# EAGLE schematic Rev 1 (EAGLE 9.5.2)

## Sheet 1 of 8: Battery and Charger
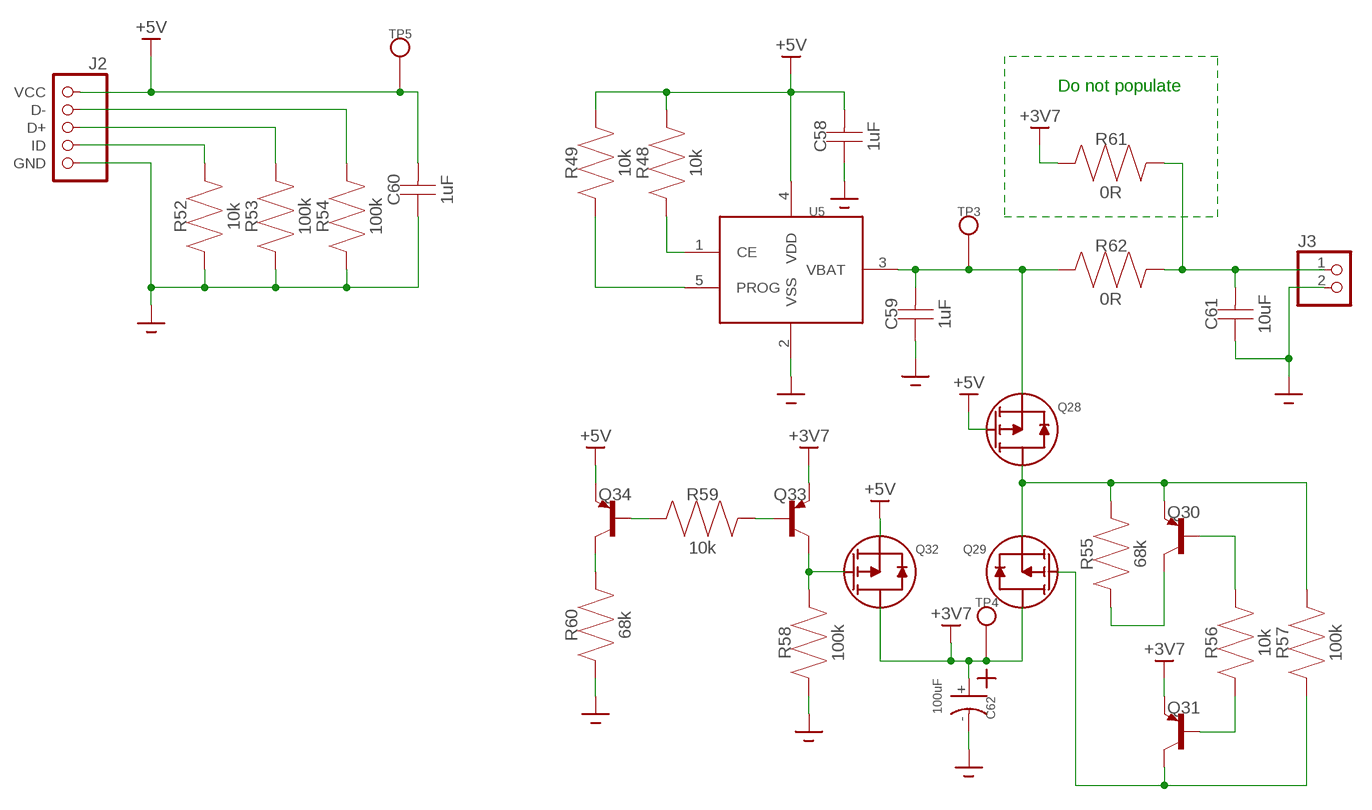
[diagram p0: schematic, sheet 1]

### Parts
C58  1uF  CAPACITOR0805  [0805]
C59  1uF  CAPACITOR0805  [0805]
C60  1uF  CAPACITOR0805  [0805]
C61  10uF  CAPACITOR0805  [0805]
C62  100uF  EEE-1EA101AP  [EEE-1EA101AP]
J2  10118194-0001LF  [10118194-0001LF]
J3  B2B-PH-K-S(LF)(SN)  [B2B-PH-K-S(LF)(SN)]
Q28  SI7157DP  [SI7157DP]
Q29  SI7157DP  [SI7157DP]
Q30  MMBT3906  [SOT96P237X112-3]
Q31  MMBT3906  [SOT96P237X112-3]
Q32  SI7157DP  [SI7157DP]
Q33  MMBT3906  [SOT96P237X112-3]
Q34  MMBT3906  [SOT96P237X112-3]
R48  10k  RESISTOR0402  [0402]
R49  10k  RESISTOR0402  [0402]
R52  10k  RESISTOR0402  [0402]
R53  100k  RESISTOR0402  [0402]
R54  100k  RESISTOR0402  [0402]
R55  68k  RESISTOR0603  [0603]
R56  10k  RESISTOR0603  [0603]
R57  100k  RESISTOR0603  [0603]
R58  100k  RESISTOR0805  [0805]
R59  10k  RESISTOR0805  [0805]
R60  68k  RESISTOR0805  [0805]
R61  0R  RESISTOR0805  [0805]
R62  0R  RESISTOR0805  [0805]
TP3  TESTPOINT  [TESTPOINT]
TP4  TESTPOINT  [TESTPOINT]
TP5  TESTPOINT  [TESTPOINT]
U5  MCP73811  [MCP73811]

### Nets
+3V7: C62.+ Q29.5(D) Q29.6(D) Q29.7(D) Q29.8(D) Q29.9(D) Q29.10(D) Q29.11(D) Q31.2(E) Q32.5(D) Q32.6(D) Q32.7(D) Q32.8(D) Q32.9(D) Q32.10(D) Q32.11(D) Q33.2(E) R61.P$1 TP4.P1 ; also sheet 2,8
+5V: C58.P$2 C60.P$2 J2.1(VCC) Q28.4(G) Q32.1(S) Q32.2(S) Q32.3(S) Q34.2(E) R48.2 R49.2 TP5.P1 U5.4(VDD)
GND: C58.P$1 C59.P$1 C60.P$1 C61.P$1 C62.- J2.5(GND) J2.6(GND) J2.7(GND) J2.8(GND) J2.9(GND) J2.10(GND) J2.11(GND) J2.12(GND) J2.13(GND) J2.14(GND) J2.15(GND) J3.2 R52.1 R53.1 R54.1 R58.P$1 R60.P$1 U5.2(VSS) ; also sheet 2,3,4,5,6,7,8
N$65: C59.P$2 Q28.1(S) Q28.2(S) Q28.3(S) R62.P$1 TP3.P1 U5.3(VBAT)
N$66: R48.1 U5.1(CE)
N$67: R49.1 U5.5(PROG)
N$68: Q30.3(C) R55.1
N$69: Q28.5(D) Q28.6(D) Q28.7(D) Q28.8(D) Q28.9(D) Q28.10(D) Q28.11(D) Q29.1(S) Q29.2(S) Q29.3(S) Q30.2(E) R55.2 R57.2
N$70: Q31.1(B) R56.1
N$71: Q30.1(B) R56.2
N$72: J2.4(ID) R52.2
N$73: J2.3(D+) R53.2
N$74: J2.2(D-) R54.2
N$75: Q29.4(G) Q31.3(C) R57.1
N$76: Q32.4(G) Q33.3(C) R58.P$2
N$77: Q34.1(B) R59.P$1
N$78: Q33.1(B) R59.P$2
N$79: Q34.3(C) R60.P$2
N$104: C61.P$2 J3.1 R61.P$2 R62.P$2

### Notes on the sheet
- Do not populate

## Sheet 2 of 8: Power Regulation
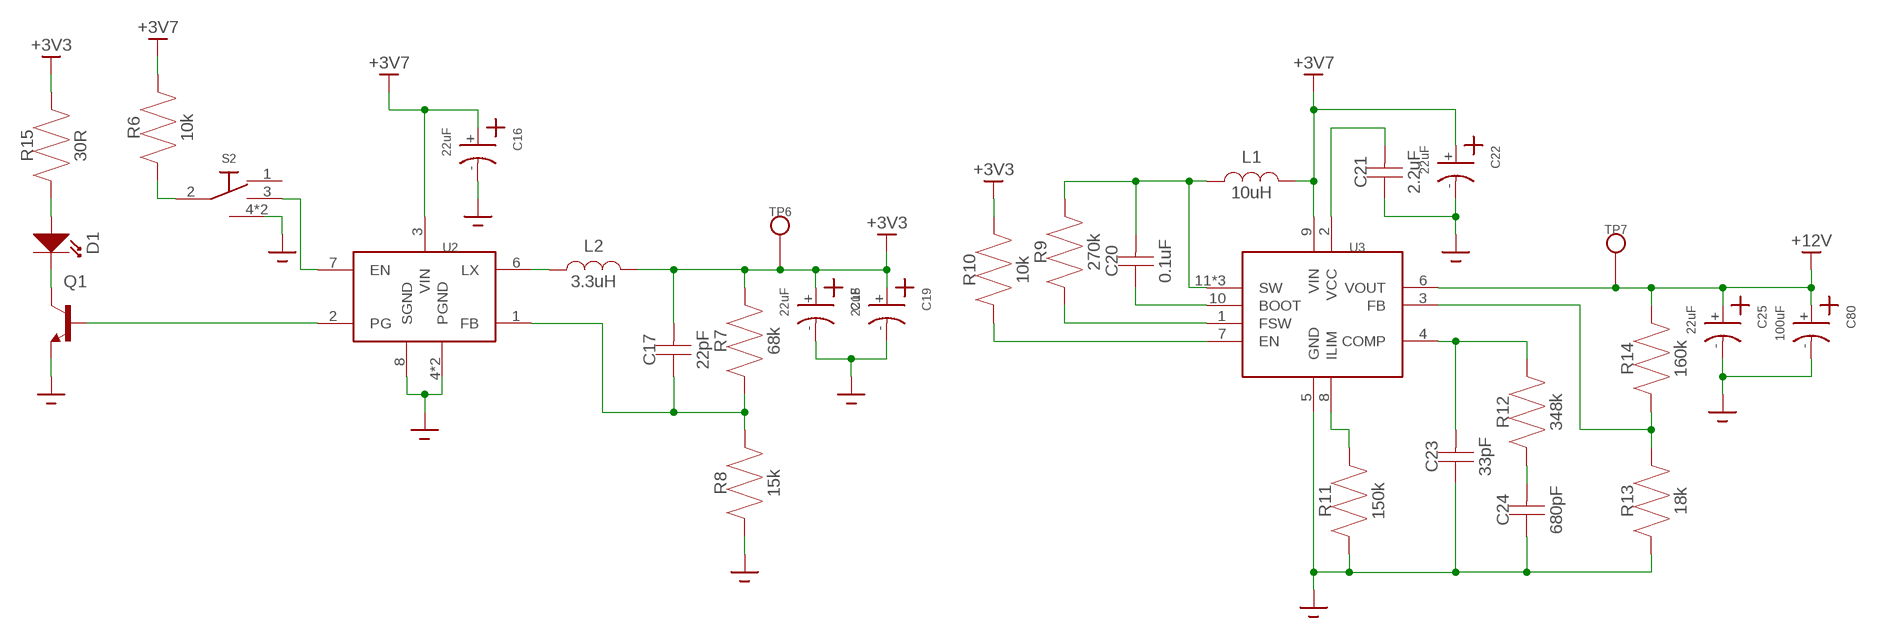
[diagram p1: schematic, sheet 2]

### Parts
C16  22uF  865080542006  [865080542006]
C17  22pF  CAPACITOR0805  [0805]
C18  22uF  865080542006  [865080542006]
C19  22uF  865080542006  [865080542006]
C20  0.1uF  CAPACITOR0402  [0402]
C21  2.2uF  CAPACITOR0402  [0402]
C22  22uF  865080542006  [865080542006]
C23  33pF  CAPACITOR0402  [0402]
C24  680pF  CAPACITOR0402  [0402]
C25  22uF  865080542006  [865080542006]
C80  100uF  EEE-1EA101AP  [EEE-1EA101AP]
D1  LED1206  [1206]
L1  10uH  104CDMCC  [104CDMCC]
L2  3.3uH  NRS5040  [NRS5040]
Q1  MMBT3904,215MMBT3904,215  [SOT95P230X110-3]
R6  10k  RESISTOR0805  [0805]
R7  68k  RESISTOR0805  [0805]
R8  15k  RESISTOR0805  [0805]
R9  270k  RESISTOR0402  [0402]
R10  10k  RESISTOR0603  [0603]
R11  150k  RESISTOR0603  [0603]
R12  348k  RESISTOR0402  [0402]
R13  18k  RESISTOR0402  [0402]
R14  160k  RESISTOR0402  [0402]
R15  30R  RESISTOR0805  [0805]
S2  OS102011MS2QN1  [OS102011MS2QN1]
TP6  TESTPOINT  [TESTPOINT]
TP7  TESTPOINT  [TESTPOINT]
U2  AP3441  [AP3441]
U3  TPS61089  [TPS61089]

### Nets
+3V3: C17.P$2 C18.+ C19.+ L2.2 R7.P$2 R10.2 R15.P$2 TP6.P1 ; also sheet 3,4,5,6,7
+3V7: C16.+ C22.+ L1.2 R6.P$2 U2.3(VIN) U3.9(VIN) ; also sheet 1,8
+12V: C25.+ C80.+ R14.2 TP7.P1 U3.6(VOUT) ; also sheet 4
GND: C16.- C18.- C19.- C21.1 C22.- C23.1 C24.1 C25.- C80.- Q1.2(E) R8.P$1 R11.1 R13.1 S2.4(GND) S2.5(GND) U2.4(PGND) U2.8(SGND) U2.9(PGND) U3.5(GND) ; also sheet 1,3,4,5,6,7,8
N$3: L2.1 U2.6(LX)
N$5: C17.P$1 R7.P$1 R8.P$2 U2.1(FB)
N$6: S2.3 U2.7(EN)
N$7: R6.P$1 S2.2(COMMON)
N$8: C20.1 U3.10(BOOT)
N$9: R9.1 U3.1(FSW)
N$10: C20.2 L1.1 R9.2 U3.11(SW) U3.12(SW) U3.13(SW)
N$11: R11.2 U3.8(ILIM)
N$12: C21.2 U3.2(VCC)
N$13: C23.2 R12.2 U3.4(COMP)
N$14: R10.1 U3.7(EN)
N$15: C24.2 R12.1
N$16: Q1.1(B) U2.2(PG)
N$17: R13.2 R14.1 U3.3(FB)
N$18: D1.2(OUT) Q1.3(C)
N$19: D1.1(IN) R15.P$1
Unconnected: S2.1

## Sheet 3 of 8: MCU
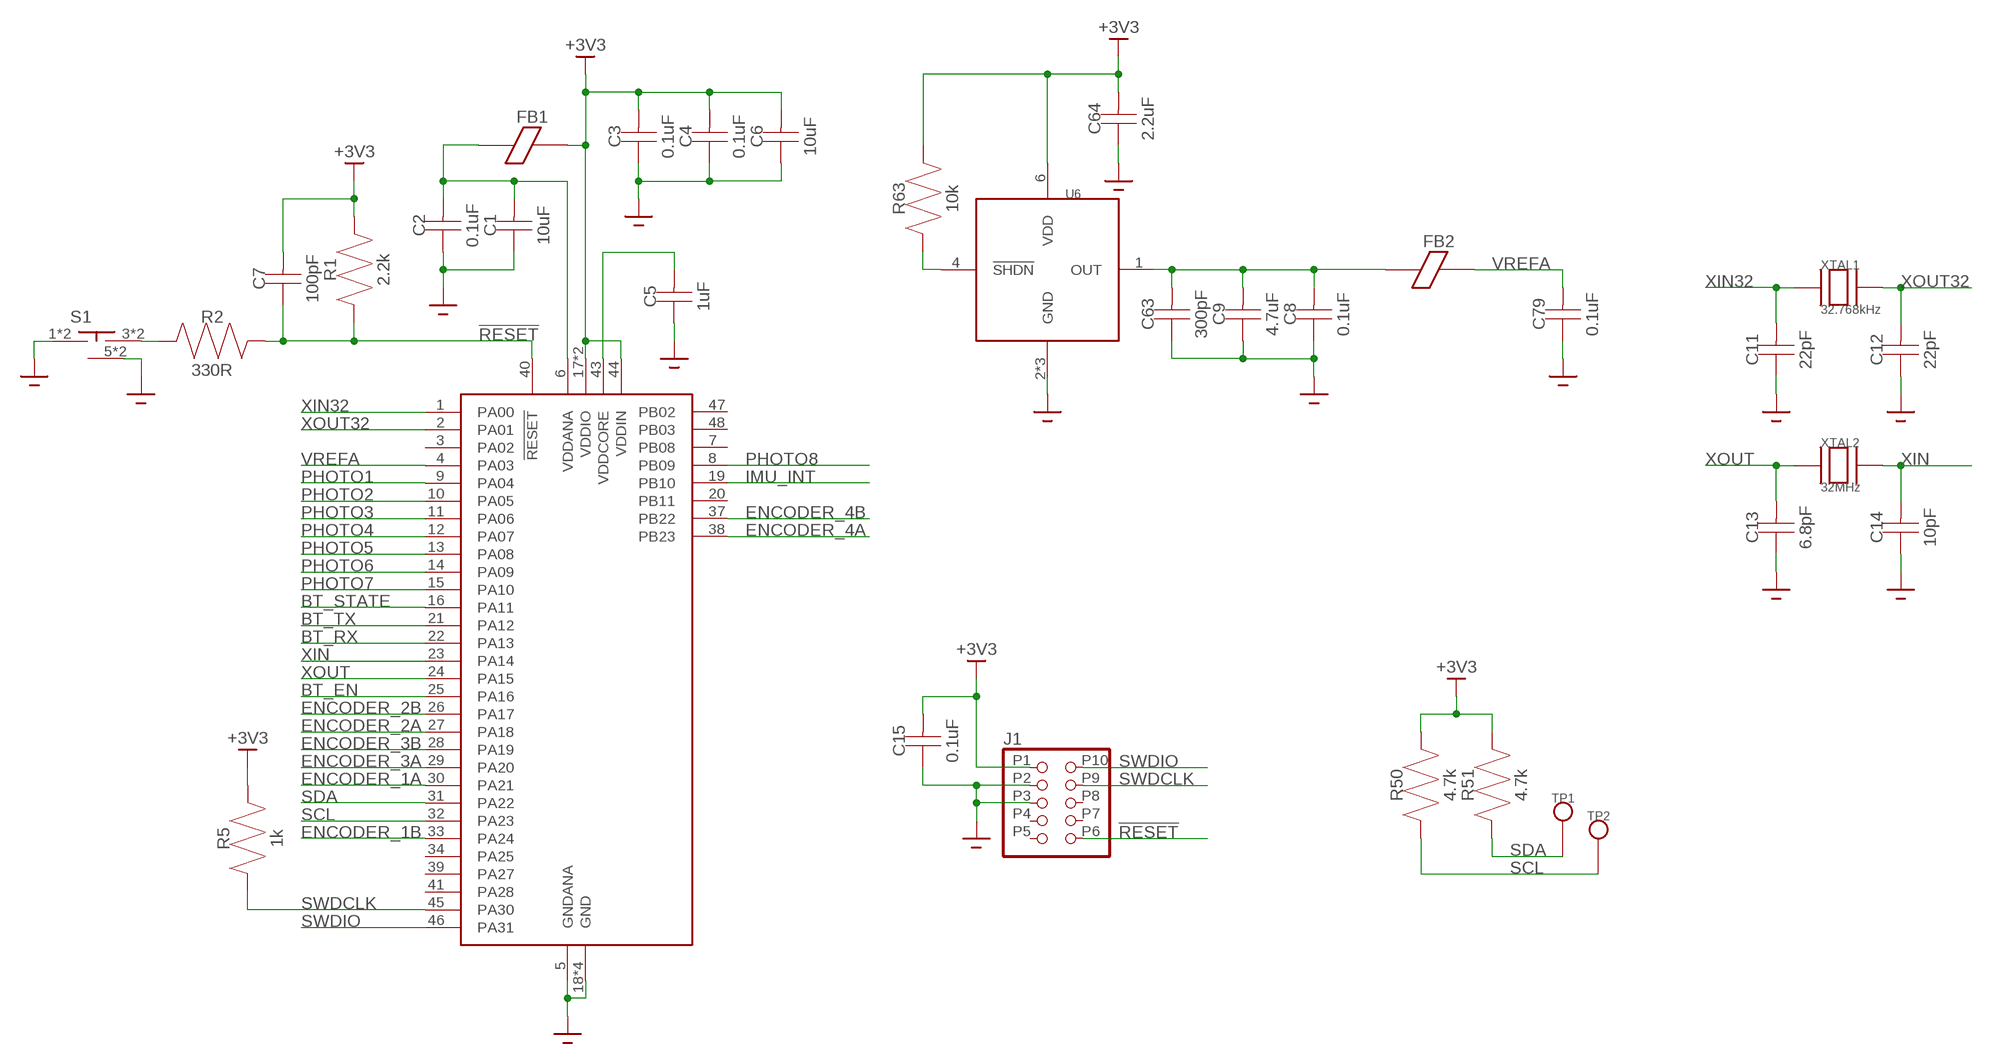
[diagram p2: schematic, sheet 3]

### Parts
C1  10uF  CAPACITOR0402  [0402]
C2  0.1uF  CAPACITOR0402  [0402]
C3  0.1uF  CAPACITOR0402  [0402]
C4  0.1uF  CAPACITOR0402  [0402]
C5  1uF  CAPACITOR0402  [0402]
C6  10uF  CAPACITOR0402  [0402]
C7  100pF  CAPACITOR0603  [0603]
C8  0.1uF  CAPACITOR0402  [0402]
C9  4.7uF  CAPACITOR0402  [0402]
C11  22pF  CAPACITOR0402  [0402]
C12  22pF  CAPACITOR0402  [0402]
C13  6.8pF  CAPACITOR0402  [0402]
C14  10pF  CAPACITOR0402  [0402]
C15  0.1uF  CAPACITOR0603  [0603]
C63  300pF  CAPACITOR0402  [0402]
C64  2.2uF  CAPACITOR0402  [0402]
C79  0.1uF  CAPACITOR0402  [0402]
FB1  FERRITE0402  [0402]
FB2  FERRITE0402  [0402]
J1  3220-10-0100-00  [3220-10-0100-00]
R1  2.2k  RESISTOR0603  [0603]
R2  330R  RESISTOR0805  [0805]
R5  1k  RESISTOR0603  [0603]
R50  4.7k  RESISTOR0603  [0603]
R51  4.7k  RESISTOR0603  [0603]
R63  10k  RESISTOR0402  [0402]
S1  PTS526SMG15SMTR2LFS  [PTS526SMG15SMTR2LFS]
TP1  TESTPOINT  [TESTPOINT]
TP2  TESTPOINT  [TESTPOINT]
U1  ATSAMD21G18A-MU  [ATSAMD21G18A-MU]
U6  MCP1501  [MCP1501]
XTAL1  32.768kHz  FC-135  [FC-135]
XTAL2  32MHz  XRCGB  [XRCGB]

### Nets
!RESET: C7.1 J1.P6 R1.1 R2.P$2 U1.40(!RESET)
+3V3: C3.2 C4.2 C6.2 C7.2 C15.2 C64.2 FB1.2 J1.P1 R1.2 R5.2 R50.2 R51.2 R63.2 U1.17(VDDIO) U1.36(VDDIO) U1.44(VDDIN) U6.6(VDD) ; also sheet 2,4,5,6,7
BT_EN: U1.25(PA16) ; also sheet 8
BT_RX: U1.22(PA13) ; also sheet 8
BT_STATE: U1.16(PA11) ; also sheet 8
BT_TX: U1.21(PA12) ; also sheet 8
ENCODER_1A: U1.30(PA21) ; also sheet 4
ENCODER_1B: U1.33(PA24) ; also sheet 4
ENCODER_2A: U1.27(PA18) ; also sheet 4
ENCODER_2B: U1.26(PA17) ; also sheet 4
ENCODER_3A: U1.29(PA20) ; also sheet 4
ENCODER_3B: U1.28(PA19) ; also sheet 4
ENCODER_4A: U1.38(PB23) ; also sheet 4
ENCODER_4B: U1.37(PB22) ; also sheet 4
GND: C1.1 C2.1 C3.1 C4.1 C5.1 C6.1 C8.1 C9.1 C11.1 C12.1 C13.1 C14.1 C15.1 C63.1 C64.1 C79.1 J1.P2 J1.P3 S1.1 S1.2 S1.5(GND) S1.6(GND) U1.5(GNDANA) U1.18(GND) U1.35(GND) U1.42(GND) U1.49(GND) U6.2(GND) U6.3(GND) U6.5(GND) ; also sheet 1,2,4,5,6,7,8
IMU_INT: U1.19(PB10) ; also sheet 5
N$1: R2.P$1 S1.3 S1.4
N$2: C5.2 U1.43(VDDCORE)
N$4: C1.2 C2.2 FB1.1 U1.6(VDDANA)
N$82: R63.1 U6.4(!SHDN)
N$999: C8.2 C9.2 C63.2 FB2.1 U6.1(OUT)
PHOTO1: U1.9(PA04) ; also sheet 6
PHOTO2: U1.10(PA05) ; also sheet 6
PHOTO3: U1.11(PA06) ; also sheet 6
PHOTO4: U1.12(PA07) ; also sheet 6
PHOTO5: U1.13(PA08) ; also sheet 6
PHOTO6: U1.14(PA09) ; also sheet 6
PHOTO7: U1.15(PA10) ; also sheet 6
PHOTO8: U1.8(PB09) ; also sheet 6
SCL: R50.1 TP2.P1 U1.32(PA23) ; also sheet 4,5,7
SDA: R51.1 TP1.P1 U1.31(PA22) ; also sheet 4,5,7
SWDCLK: J1.P9 R5.1 U1.45(PA30)
SWDIO: J1.P10 U1.46(PA31)
VREFA: C79.2 FB2.2 U1.4(PA03)
XIN: C14.2 U1.23(PA14) XTAL2.2 XTAL2.4
XIN32: C11.2 U1.1(PA00) XTAL1.1
XOUT: C13.2 U1.24(PA15) XTAL2.1 XTAL2.3
XOUT32: C12.2 U1.2(PA01) XTAL1.2
Unconnected: J1.P4 J1.P5 J1.P7 J1.P8 U1.3(PA02) U1.7(PB08) U1.20(PB11) U1.34(PA25) U1.39(PA27) U1.41(PA28) U1.47(PB02) U1.48(PB03)

## Sheet 4 of 8: Motor Drivers and Encoders
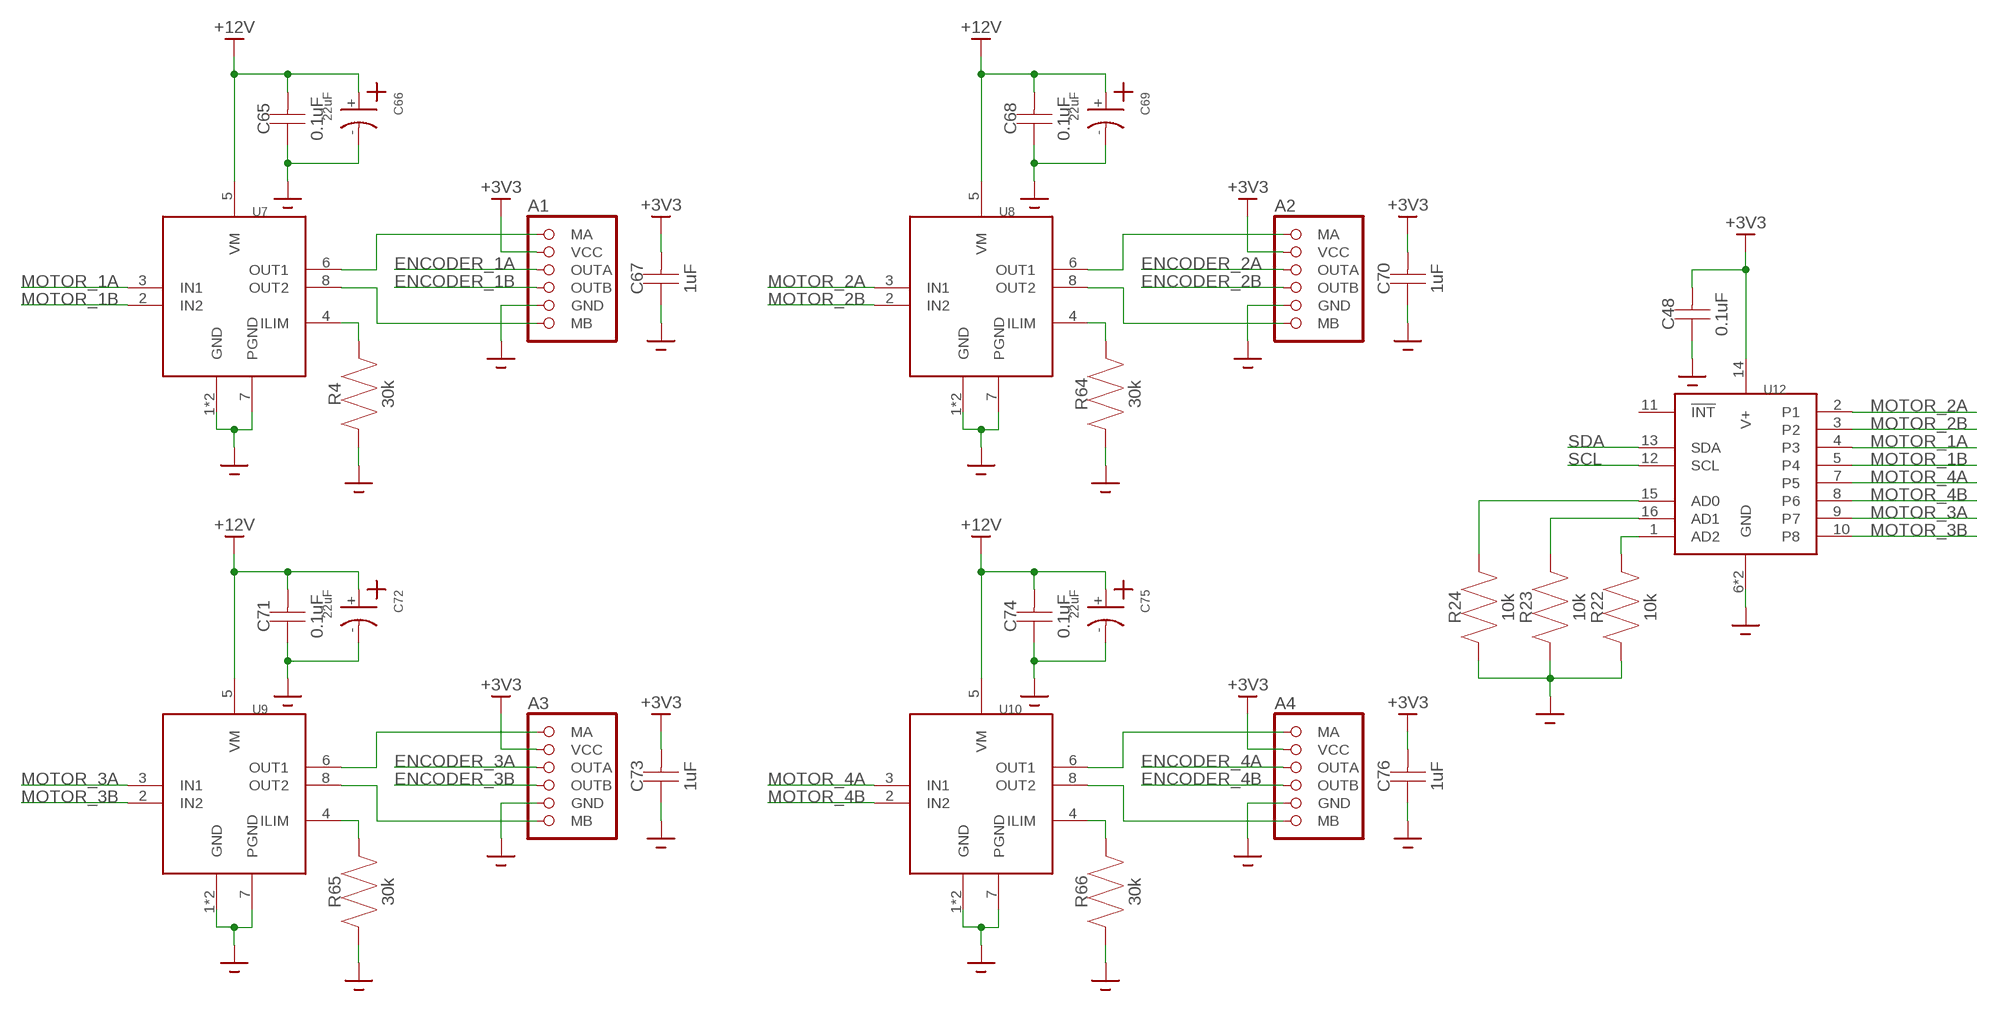
[diagram p3: schematic, sheet 4]

### Parts
A1  ENCODERSLOT  [ENCODER-SLOT]
A2  ENCODERSLOT  [ENCODER-SLOT]
A3  ENCODERSLOT  [ENCODER-SLOT]
A4  ENCODERSLOT  [ENCODER-SLOT]
C48  0.1uF  CAPACITOR0603  [0603]
C65  0.1uF  CAPACITOR0805  [0805]
C66  22uF  865080542006  [865080542006]
C67  1uF  CAPACITOR0805  [0805]
C68  0.1uF  CAPACITOR0805  [0805]
C69  22uF  865080542006  [865080542006]
C70  1uF  CAPACITOR0805  [0805]
C71  0.1uF  CAPACITOR0805  [0805]
C72  22uF  865080542006  [865080542006]
C73  1uF  CAPACITOR0805  [0805]
C74  0.1uF  CAPACITOR0805  [0805]
C75  22uF  865080542006  [865080542006]
C76  1uF  CAPACITOR0805  [0805]
R4  30k  RESISTOR0805  [0805]
R22  10k  RESISTOR0603  [0603]
R23  10k  RESISTOR0603  [0603]
R24  10k  RESISTOR0603  [0603]
R64  30k  RESISTOR0805  [0805]
R65  30k  RESISTOR0805  [0805]
R66  30k  RESISTOR0805  [0805]
U7  DRV8871  [DRV8871]
U8  DRV8871  [DRV8871]
U9  DRV8871  [DRV8871]
U10  DRV8871  [DRV8871]
U12  MAX7315  [MAX7315]

### Nets
+3V3: A1.2(VCC) A2.2(VCC) A3.2(VCC) A4.2(VCC) C48.2 C67.P$2 C70.P$2 C73.P$2 C76.P$2 U12.14(V+) ; also sheet 2,3,5,6,7
+12V: C65.P$2 C66.+ C68.P$2 C69.+ C71.P$2 C72.+ C74.P$2 C75.+ U7.5(VM) U8.5(VM) U9.5(VM) U10.5(VM) ; also sheet 2
ENCODER_1A: A1.3(OUTA) ; also sheet 3
ENCODER_1B: A1.4(OUTB) ; also sheet 3
ENCODER_2A: A2.3(OUTA) ; also sheet 3
ENCODER_2B: A2.4(OUTB) ; also sheet 3
ENCODER_3A: A3.3(OUTA) ; also sheet 3
ENCODER_3B: A3.4(OUTB) ; also sheet 3
ENCODER_4A: A4.3(OUTA) ; also sheet 3
ENCODER_4B: A4.4(OUTB) ; also sheet 3
GND: A1.5(GND) A2.5(GND) A3.5(GND) A4.5(GND) C48.1 C65.P$1 C66.- C67.P$1 C68.P$1 C69.- C70.P$1 C71.P$1 C72.- C73.P$1 C74.P$1 C75.- C76.P$1 R4.P$1 R22.1 R23.1 R24.1 R64.P$1 R65.P$1 R66.P$1 U7.1(GND) U7.7(PGND) U7.9(GND) U8.1(GND) U8.7(PGND) U8.9(GND) U9.1(GND) U9.7(PGND) U9.9(GND) U10.1(GND) U10.7(PGND) U10.9(GND) U12.6(GND) U12.17(GND) ; also sheet 1,2,3,5,6,7,8
MOTOR_1A: U7.3(IN1) U12.4(P3)
MOTOR_1B: U7.2(IN2) U12.5(P4)
MOTOR_2A: U8.3(IN1) U12.2(P1)
MOTOR_2B: U8.2(IN2) U12.3(P2)
MOTOR_3A: U9.3(IN1) U12.9(P7)
MOTOR_3B: U9.2(IN2) U12.10(P8)
MOTOR_4A: U10.3(IN1) U12.7(P5)
MOTOR_4B: U10.2(IN2) U12.8(P6)
N$21: R22.2 U12.1(AD2)
N$22: R23.2 U12.16(AD1)
N$23: R24.2 U12.15(AD0)
N$80: A1.1(MA) U7.6(OUT1)
N$83: R4.P$2 U7.4(ILIM)
N$84: A1.6(MB) U7.8(OUT2)
N$85: R64.P$2 U8.4(ILIM)
N$86: A2.1(MA) U8.6(OUT1)
N$87: A2.6(MB) U8.8(OUT2)
N$88: R65.P$2 U9.4(ILIM)
N$89: A3.1(MA) U9.6(OUT1)
N$90: A3.6(MB) U9.8(OUT2)
N$91: R66.P$2 U10.4(ILIM)
N$92: A4.1(MA) U10.6(OUT1)
N$93: A4.6(MB) U10.8(OUT2)
SCL: U12.12(SCL) ; also sheet 3,5,7
SDA: U12.13(SDA) ; also sheet 3,5,7
Unconnected: U12.11(!INT)

## Sheet 5 of 8: IMU
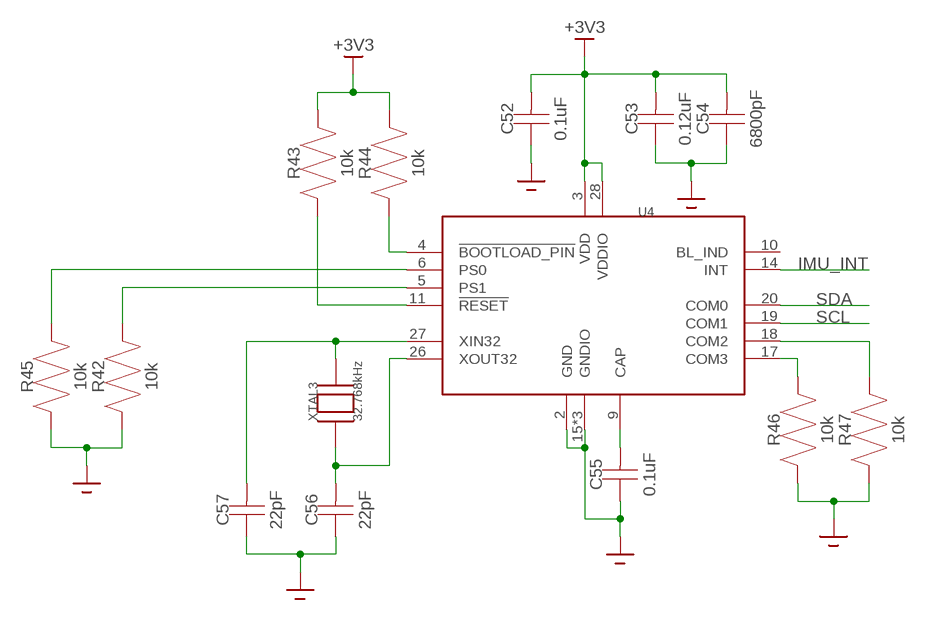
[diagram p4: schematic, sheet 5]

### Parts
C52  0.1uF  CAPACITOR0603  [0603]
C53  0.12uF  CAPACITOR0603  [0603]
C54  6800pF  CAPACITOR0603  [0603]
C55  0.1uF  CAPACITOR0603  [0603]
C56  22pF  CAPACITOR0603  [0603]
C57  22pF  CAPACITOR0603  [0603]
R42  10k  RESISTOR0603  [0603]
R43  10k  RESISTOR0603  [0603]
R44  10k  RESISTOR0603  [0603]
R45  10k  RESISTOR0603  [0603]
R46  10k  RESISTOR0603  [0603]
R47  10k  RESISTOR0603  [0603]
U4  BNO055  [BNO055]
XTAL3  32.768kHz  FC-135  [FC-135]

### Nets
+3V3: C52.2 C53.2 C54.2 R43.2 R44.2 U4.3(VDD) U4.28(VDDIO) ; also sheet 2,3,4,6,7
GND: C52.1 C53.1 C54.1 C55.1 C56.1 C57.1 R42.1 R45.1 R46.1 R47.1 U4.2(GND) U4.15(GNDIO) U4.16(GNDIO) U4.25(GNDIO) ; also sheet 1,2,3,4,6,7,8
IMU_INT: U4.14(INT) ; also sheet 3
N$56: C55.2 U4.9(CAP)
N$57: R44.1 U4.4(!BOOTLOAD_PIN)
N$58: C56.2 U4.26(XOUT32) XTAL3.1
N$59: R42.2 U4.5(PS1)
N$60: C57.2 U4.27(XIN32) XTAL3.2
N$61: R45.2 U4.6(PS0)
N$62: R43.1 U4.11(!RESET)
N$63: R46.2 U4.17(COM3)
N$64: R47.2 U4.18(COM2)
SCL: U4.19(COM1) ; also sheet 3,4,7
SDA: U4.20(COM0) ; also sheet 3,4,7
Unconnected: U4.10(BL_IND)

## Sheet 6 of 8: IR Sensors
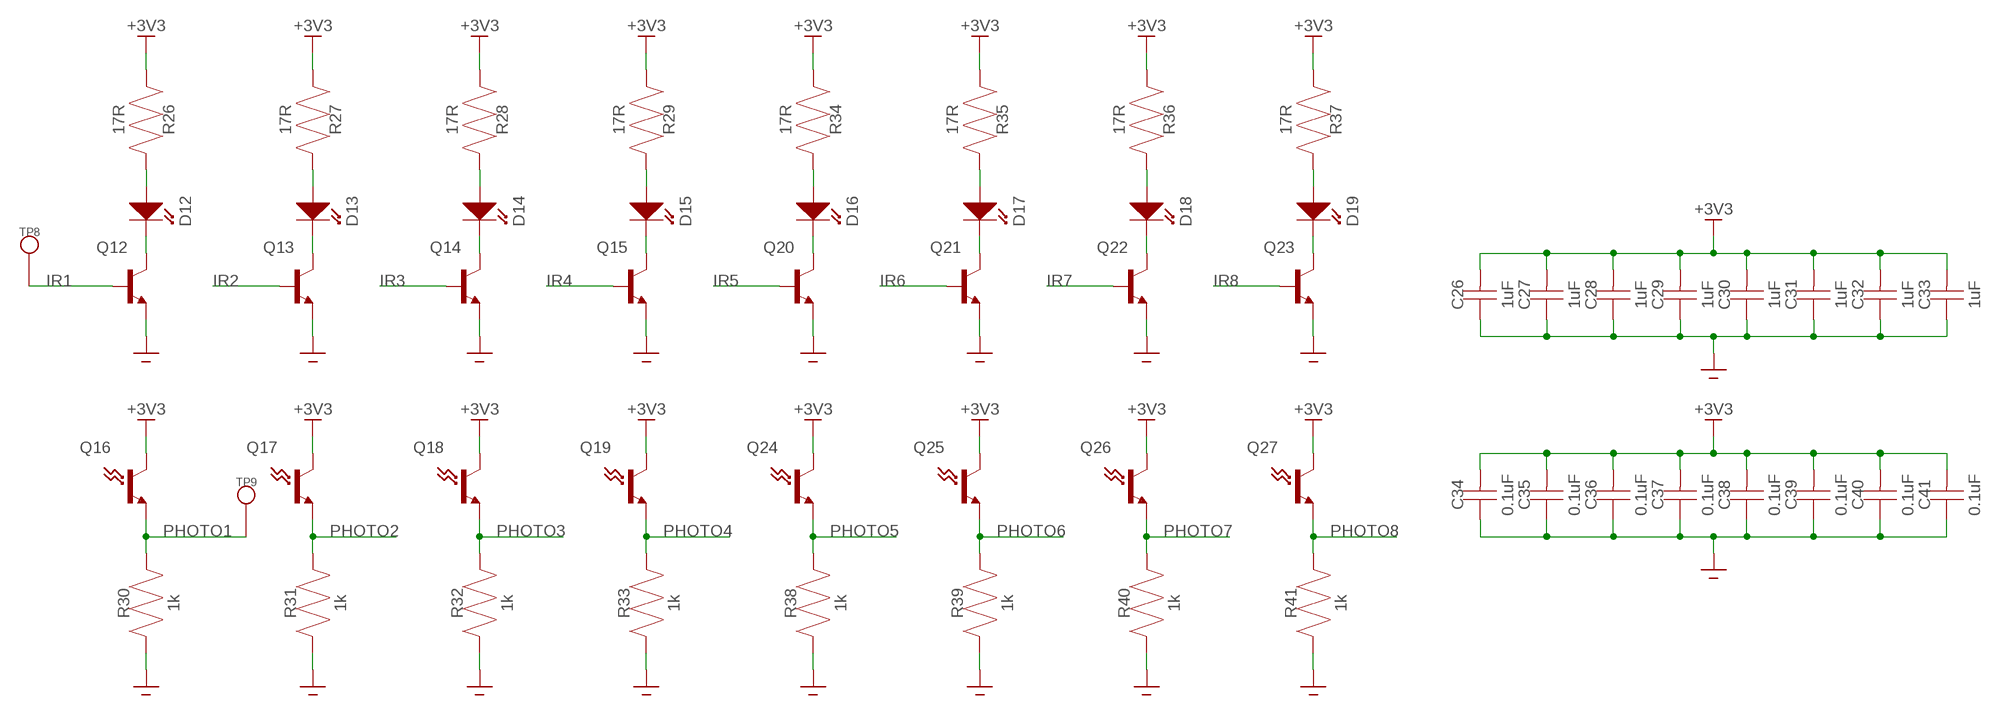
[diagram p5: schematic, sheet 6]

### Parts
C26  1uF  CAPACITOR0805  [0805]
C27  1uF  CAPACITOR0805  [0805]
C28  1uF  CAPACITOR0805  [0805]
C29  1uF  CAPACITOR0805  [0805]
C30  1uF  CAPACITOR0805  [0805]
C31  1uF  CAPACITOR0805  [0805]
C32  1uF  CAPACITOR0805  [0805]
C33  1uF  CAPACITOR0603  [0603]
C34  0.1uF  CAPACITOR0805  [0805]
C35  0.1uF  CAPACITOR0805  [0805]
C36  0.1uF  CAPACITOR0805  [0805]
C37  0.1uF  CAPACITOR0805  [0805]
C38  0.1uF  CAPACITOR0805  [0805]
C39  0.1uF  CAPACITOR0805  [0805]
C40  0.1uF  CAPACITOR0603  [0603]
C41  0.1uF  CAPACITOR0805  [0805]
D12  SFH4545  [SFH4545]
D13  SFH4545  [SFH4545]
D14  SFH4545  [SFH4545]
D15  SFH4545  [SFH4545]
D16  SFH4545  [SFH4545]
D17  SFH4545  [SFH4545]
D18  SFH4545  [SFH4545]
D19  SFH4545  [SFH4545]
Q12  MMBT3904,215MMBT3904,215  [SOT95P230X110-3]
Q13  MMBT3904,215MMBT3904,215  [SOT95P230X110-3]
Q14  MMBT3904,215MMBT3904,215  [SOT95P230X110-3]
Q15  MMBT3904,215MMBT3904,215  [SOT95P230X110-3]
Q16  TEFT4300  [TEFT4300]
Q17  TEFT4300  [TEFT4300]
Q18  TEFT4300  [TEFT4300]
Q19  TEFT4300  [TEFT4300]
Q20  MMBT3904,215MMBT3904,215  [SOT95P230X110-3]
Q21  MMBT3904,215MMBT3904,215  [SOT95P230X110-3]
Q22  MMBT3904,215MMBT3904,215  [SOT95P230X110-3]
Q23  MMBT3904,215MMBT3904,215  [SOT95P230X110-3]
Q24  TEFT4300  [TEFT4300]
Q25  TEFT4300  [TEFT4300]
Q26  TEFT4300  [TEFT4300]
Q27  TEFT4300  [TEFT4300]
R26  17R  RESISTOR0805  [0805]
R27  17R  RESISTOR0805  [0805]
R28  17R  RESISTOR0805  [0805]
R29  17R  RESISTOR0805  [0805]
R30  1k  RESISTOR0805  [0805]
R31  1k  RESISTOR0805  [0805]
R32  1k  RESISTOR0805  [0805]
R33  1k  RESISTOR0805  [0805]
R34  17R  RESISTOR0805  [0805]
R35  17R  RESISTOR0805  [0805]
R36  17R  RESISTOR0805  [0805]
R37  17R  RESISTOR0805  [0805]
R38  1k  RESISTOR0805  [0805]
R39  1k  RESISTOR0805  [0805]
R40  1k  RESISTOR0603  [0603]
R41  1k  RESISTOR0805  [0805]
TP8  TESTPOINT  [TESTPOINT]
TP9  TESTPOINT  [TESTPOINT]

### Nets
+3V3: C26.P$2 C27.P$2 C28.P$2 C29.P$2 C30.P$2 C31.P$2 C32.P$2 C33.2 C34.P$2 C35.P$2 C36.P$2 C37.P$2 C38.P$2 C39.P$2 C40.2 C41.P$2 Q16.C Q17.C Q18.C Q19.C Q24.C Q25.C Q26.C Q27.C R26.P$1 R27.P$1 R28.P$1 R29.P$1 R34.P$1 R35.P$1 R36.P$1 R37.P$1 ; also sheet 2,3,4,5,7
GND: C26.P$1 C27.P$1 C28.P$1 C29.P$1 C30.P$1 C31.P$1 C32.P$1 C33.1 C34.P$1 C35.P$1 C36.P$1 C37.P$1 C38.P$1 C39.P$1 C40.1 C41.P$1 Q12.2(E) Q13.2(E) Q14.2(E) Q15.2(E) Q20.2(E) Q21.2(E) Q22.2(E) Q23.2(E) R30.P$1 R31.P$1 R32.P$1 R33.P$1 R38.P$1 R39.P$1 R40.1 R41.P$1 ; also sheet 1,2,3,4,5,7,8
IR1: Q12.1(B) TP8.P1 ; also sheet 7
IR2: Q13.1(B) ; also sheet 7
IR3: Q14.1(B) ; also sheet 7
IR4: Q15.1(B) ; also sheet 7
IR5: Q20.1(B) ; also sheet 7
IR6: Q21.1(B) ; also sheet 7
IR7: Q22.1(B) ; also sheet 7
IR8: Q23.1(B) ; also sheet 7
N$40: D12.-(OUT) Q12.3(C)
N$41: D12.+(IN) R26.P$2
N$42: D13.-(OUT) Q13.3(C)
N$43: D13.+(IN) R27.P$2
N$44: D14.-(OUT) Q14.3(C)
N$45: D14.+(IN) R28.P$2
N$46: D15.-(OUT) Q15.3(C)
N$47: D15.+(IN) R29.P$2
N$48: D16.-(OUT) Q20.3(C)
N$49: D16.+(IN) R34.P$2
N$50: D17.-(OUT) Q21.3(C)
N$51: D17.+(IN) R35.P$2
N$52: D18.-(OUT) Q22.3(C)
N$53: D18.+(IN) R36.P$2
N$54: D19.-(OUT) Q23.3(C)
N$55: D19.+(IN) R37.P$2
PHOTO1: Q16.E R30.P$2 TP9.P1 ; also sheet 3
PHOTO2: Q17.E R31.P$2 ; also sheet 3
PHOTO3: Q18.E R32.P$2 ; also sheet 3
PHOTO4: Q19.E R33.P$2 ; also sheet 3
PHOTO5: Q24.E R38.P$2 ; also sheet 3
PHOTO6: Q25.E R39.P$2 ; also sheet 3
PHOTO7: Q26.E R40.2 ; also sheet 3
PHOTO8: Q27.E R41.P$2 ; also sheet 3

## Sheet 7 of 8: LEDs
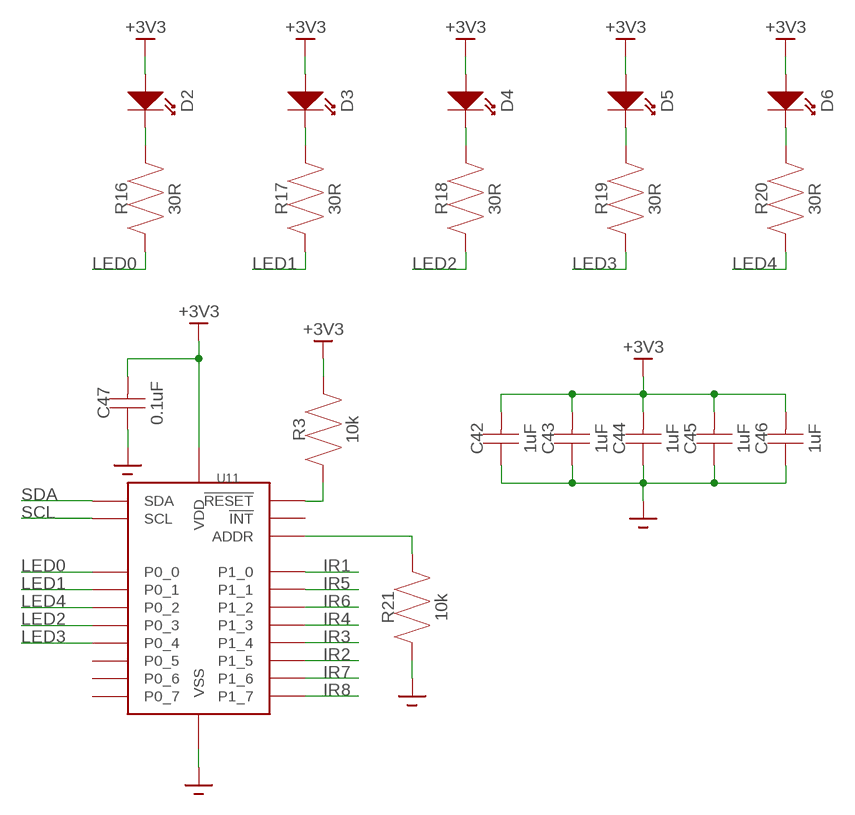
[diagram p6: schematic, sheet 7]

### Parts
C42  1uF  CAPACITOR0603  [0603]
C43  1uF  CAPACITOR0603  [0603]
C44  1uF  CAPACITOR0603  [0603]
C45  1uF  CAPACITOR0603  [0603]
C46  1uF  CAPACITOR0603  [0603]
C47  0.1uF  CAPACITOR0603  [0603]
D2  LED1206  [1206]
D3  LED1206  [1206]
D4  LED1206  [1206]
D5  LED1206  [1206]
D6  LED1206  [1206]
R3  10k  RESISTOR0603  [0603]
R16  30R  RESISTOR0603  [0603]
R17  30R  RESISTOR0603  [0603]
R18  30R  RESISTOR0603  [0603]
R19  30R  RESISTOR0603  [0603]
R20  30R  RESISTOR0603  [0603]
R21  10k  RESISTOR0603  [0603]
U11  PCAL6416A  [PCAL6416A]

### Nets
+3V3: C42.2 C43.2 C44.2 C45.2 C46.2 C47.2 D2.1(IN) D3.1(IN) D4.1(IN) D5.1(IN) D6.1(IN) R3.2 U11.21(VDD) U11.23(VDD) ; also sheet 2,3,4,5,6
GND: C42.1 C43.1 C44.1 C45.1 C46.1 C47.1 R21.1 U11.9(VSS) U11.25(VSS) ; also sheet 1,2,3,4,5,6,8
IR1: U11.10(P1_0) ; also sheet 6
IR2: U11.15(P1_5) ; also sheet 6
IR3: U11.14(P1_4) ; also sheet 6
IR4: U11.13(P1_3) ; also sheet 6
IR5: U11.11(P1_1) ; also sheet 6
IR6: U11.12(P1_2) ; also sheet 6
IR7: U11.16(P1_6) ; also sheet 6
IR8: U11.17(P1_7) ; also sheet 6
LED0: R16.1 U11.1(P0_0)
LED1: R17.1 U11.2(P0_1)
LED2: R18.1 U11.4(P0_3)
LED3: R19.1 U11.5(P0_4)
LED4: R20.1 U11.3(P0_2)
N$25: D2.2(OUT) R16.2
N$26: D3.2(OUT) R17.2
N$27: D4.2(OUT) R18.2
N$28: D5.2(OUT) R19.2
N$29: D6.2(OUT) R20.2
N$31: R3.1 U11.24(!RESET)
N$32: R21.2 U11.18(ADDR)
SCL: U11.19(SCL) ; also sheet 3,4,5
SDA: U11.20(SDA) ; also sheet 3,4,5
Unconnected: U11.6(P0_5) U11.7(P0_6) U11.8(P0_7) U11.22(!INT)

## Sheet 8 of 8: Bluetooth
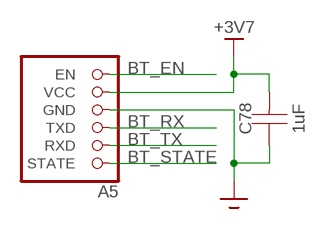
[diagram p7: schematic, sheet 8]

### Parts
A5  HC-05  [HC-05]
C78  1uF  CAPACITOR0603  [0603]

### Nets
+3V7: A5.5(VCC) C78.2 ; also sheet 1,2
BT_EN: A5.6(EN) ; also sheet 3
BT_RX: A5.3(TXD) ; also sheet 3
BT_STATE: A5.1(STATE) ; also sheet 3
BT_TX: A5.2(RXD) ; also sheet 3
GND: A5.4(GND) C78.1 ; also sheet 1,2,3,4,5,6,7

## Library data of the parts
A1-A4 = Micromouse 2020:ENCODER
A5 = Micromouse 2020:HC-05
C1-C9 C11-C15 C17 C20 C21 C23 C24 C26-C48 C52-C61 C63-C65 C67 C68 C70 C71 C73 C74 C76 C78 C79 = Micromouse 2020:CAPACITOR
C16 C18 C19 C22 C25 C66 C69 C72 C75 = Micromouse 2020:865080542006
C62 C80 = Micromouse 2020:EEE-1EA101AP
D1-D6 = Micromouse 2020:LED
D12-D19 = Micromouse 2020:SFH4545
FB1 FB2 = Micromouse 2020:FERRITE
J1 = Micromouse 2020:3220-10-0100-00
J2 = Micromouse 2020:10118194-0001LF
J3 = Micromouse 2020:B2B-PH-K-S(LF)(SN)
L1 = Micromouse 2020:104CDMCC
L2 = Micromouse 2020:NRS5040
Q1 Q12-Q15 Q20-Q23 = Micromouse 2020:MMBT3904,215: Trans GP BJT NPN 40V 0.2A 250mW Automotive 3-Pin TO-236AB T/R
Q16-Q19 Q24-Q27 = Micromouse 2020:TEFT4300
Q28 Q29 Q32 = Micromouse 2020:SI7157DP
Q30 Q31 Q33 Q34 = Micromouse 2020:MMBT3906
R1-R24 R26-R66 = Micromouse 2020:RESISTOR
S1 = Micromouse 2020:PTS526SMG15SMTR2LFS
S2 = Micromouse 2020:OS102011MS2QN1
TP1-TP9 = Micromouse 2020:TESTPOINT
U1 = Micromouse 2020:ATSAMD21G18A-MU
U2 = Micromouse 2020:AP3441
U3 = Micromouse 2020:TPS61089
U4 = Micromouse 2020:BNO055
U5 = Micromouse 2020:MCP73811
U6 = Micromouse 2020:MCP1501
U7-U10 = Micromouse 2020:DRV8871
U11 = Micromouse 2020:PCAL6416A
U12 = Micromouse 2020:MAX7315
XTAL1 XTAL3 = Micromouse 2020:FC-135
XTAL2 = Micromouse 2020:XRCGB